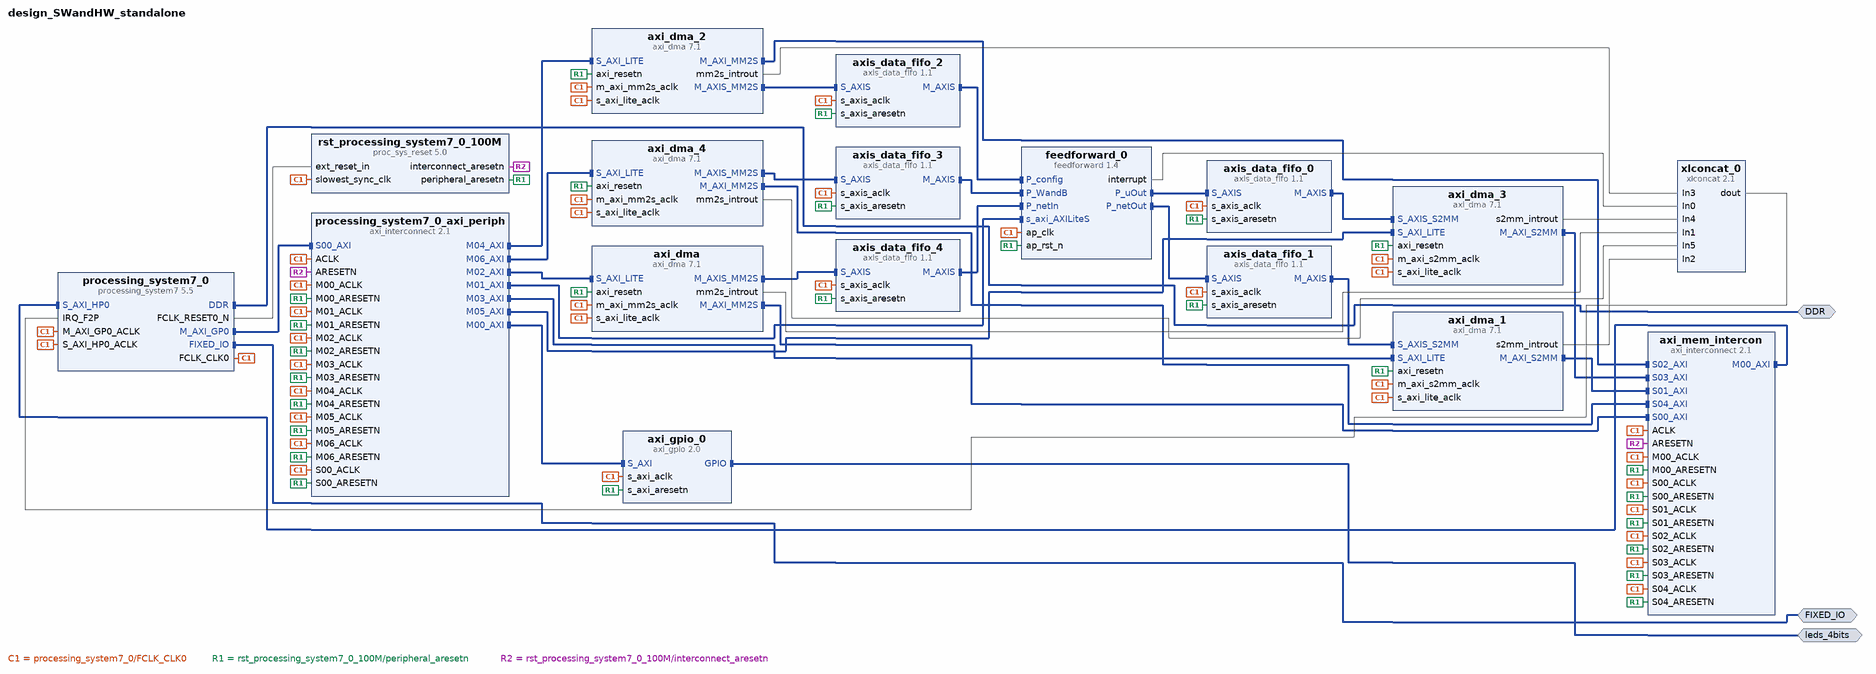
[diagram p0: block diagram of the top level]
# Vivado block design design_SWandHW_standalone, Vivado 2015.4.2
create_bd_design design_SWandHW_standalone

create_bd_intf_port -mode Master -vlnv xilinx.com:interface:ddrx_rtl:1.0 DDR
create_bd_intf_port -mode Master -vlnv xilinx.com:display_processing_system7:fixedio_rtl:1.0 FIXED_IO
create_bd_intf_port -mode Master -vlnv xilinx.com:interface:gpio_rtl:1.0 leds_4bits

create_bd_cell -type ip -vlnv xilinx.com:ip:processing_system7:5.5 processing_system7_0
set_property -dict [list \
  CONFIG.PCW_UIPARAM_DDR_FREQ_MHZ 525 \
  CONFIG.PCW_CRYSTAL_PERIPHERAL_FREQMHZ 50.000000 \
  CONFIG.PCW_APU_PERIPHERAL_FREQMHZ 650 \
  CONFIG.PCW_SDIO_PERIPHERAL_FREQMHZ 50 \
  CONFIG.PCW_FPGA0_PERIPHERAL_FREQMHZ 100 \
  CONFIG.PCW_USE_S_AXI_HP0 1 \
  CONFIG.PCW_USE_FABRIC_INTERRUPT 1 \
  CONFIG.PCW_S_AXI_HP0_DATA_WIDTH 32 \
  CONFIG.PCW_IRQ_F2P_INTR 1 \
  CONFIG.PCW_PRESET_BANK1_VOLTAGE {LVCMOS 1.8V} \
  CONFIG.PCW_UIPARAM_DDR_PARTNO {MT41K128M16 JT-125} \
  CONFIG.PCW_QSPI_PERIPHERAL_ENABLE 1 \
  CONFIG.PCW_QSPI_GRP_SINGLE_SS_ENABLE 1 \
  CONFIG.PCW_QSPI_GRP_FBCLK_ENABLE 1 \
  CONFIG.PCW_ENET0_PERIPHERAL_ENABLE 1 \
  CONFIG.PCW_ENET0_ENET0_IO {MIO 16 .. 27} \
  CONFIG.PCW_ENET0_GRP_MDIO_ENABLE 1 \
  CONFIG.PCW_ENET0_RESET_ENABLE 0 \
  CONFIG.PCW_SD0_PERIPHERAL_ENABLE 1 \
  CONFIG.PCW_SD0_GRP_CD_ENABLE 1 \
  CONFIG.PCW_SD0_GRP_CD_IO {MIO 47} \
  CONFIG.PCW_SD0_GRP_WP_ENABLE 1 \
  CONFIG.PCW_UART1_PERIPHERAL_ENABLE 1 \
  CONFIG.PCW_TTC0_PERIPHERAL_ENABLE 1 \
  CONFIG.PCW_USB0_PERIPHERAL_ENABLE 1 \
  CONFIG.PCW_USB0_RESET_ENABLE 1 \
  CONFIG.PCW_USB0_RESET_IO {MIO 46} \
  CONFIG.PCW_GPIO_MIO_GPIO_ENABLE 1 \
] [get_bd_cells processing_system7_0]
# 105 more settings of processing_system7_0 are not shown: defaults, MIO pin electricals, DDR timing, and values the tool derives
create_bd_cell -type ip -vlnv xilinx.com:ip:axi_gpio:2.0 axi_gpio_0
set_property -dict {CONFIG.USE_BOARD_FLOW true CONFIG.GPIO_BOARD_INTERFACE leds_4bits} [get_bd_cells axi_gpio_0]
create_bd_cell -type ip -vlnv xilinx.com:ip:axi_interconnect:2.1 processing_system7_0_axi_periph
set_property -dict {CONFIG.NUM_MI 7} [get_bd_cells processing_system7_0_axi_periph]
create_bd_cell -type ip -vlnv xilinx.com:ip:proc_sys_reset:5.0 rst_processing_system7_0_100M
create_bd_cell -type ip -vlnv UC3M:MISEA_Thesis:feedforward:1.4 feedforward_0
create_bd_cell -type ip -vlnv xilinx.com:ip:xlconcat:2.1 xlconcat_0
set_property -dict {CONFIG.NUM_PORTS 6} [get_bd_cells xlconcat_0]
create_bd_cell -type ip -vlnv xilinx.com:ip:axi_dma:7.1 axi_dma
set_property -dict [list \
  CONFIG.c_include_sg 0 \
  CONFIG.c_m_axi_mm2s_data_width 32 \
  CONFIG.c_m_axis_mm2s_tdata_width 32 \
  CONFIG.c_include_mm2s_dre 1 \
  CONFIG.c_mm2s_burst_size 256 \
  CONFIG.c_include_s2mm 0 \
] [get_bd_cells axi_dma]
create_bd_cell -type ip -vlnv xilinx.com:ip:axi_interconnect:2.1 axi_mem_intercon
set_property -dict {CONFIG.NUM_SI 5 CONFIG.NUM_MI 1} [get_bd_cells axi_mem_intercon]
create_bd_cell -type ip -vlnv xilinx.com:ip:axi_dma:7.1 axi_dma_1
set_property -dict [list \
  CONFIG.c_include_sg 0 \
  CONFIG.c_include_mm2s 0 \
  CONFIG.c_include_s2mm_dre 1 \
  CONFIG.c_s2mm_burst_size 256 \
] [get_bd_cells axi_dma_1]
create_bd_cell -type ip -vlnv xilinx.com:ip:axi_dma:7.1 axi_dma_2
set_property -dict [list \
  CONFIG.c_include_sg 0 \
  CONFIG.c_m_axi_mm2s_data_width 32 \
  CONFIG.c_m_axis_mm2s_tdata_width 32 \
  CONFIG.c_include_mm2s_dre 1 \
  CONFIG.c_mm2s_burst_size 256 \
  CONFIG.c_include_s2mm 0 \
] [get_bd_cells axi_dma_2]
create_bd_cell -type ip -vlnv xilinx.com:ip:axi_dma:7.1 axi_dma_3
set_property -dict [list \
  CONFIG.c_include_sg 0 \
  CONFIG.c_include_mm2s 0 \
  CONFIG.c_include_s2mm_dre 1 \
  CONFIG.c_s2mm_burst_size 256 \
] [get_bd_cells axi_dma_3]
create_bd_cell -type ip -vlnv xilinx.com:ip:axi_dma:7.1 axi_dma_4
set_property -dict [list \
  CONFIG.c_include_sg 0 \
  CONFIG.c_m_axi_mm2s_data_width 32 \
  CONFIG.c_m_axis_mm2s_tdata_width 32 \
  CONFIG.c_include_mm2s_dre 1 \
  CONFIG.c_mm2s_burst_size 256 \
  CONFIG.c_include_s2mm 0 \
] [get_bd_cells axi_dma_4]
create_bd_cell -type ip -vlnv xilinx.com:ip:axis_data_fifo:1.1 axis_data_fifo_0
set_property -dict {CONFIG.HAS_TKEEP 1 CONFIG.HAS_TLAST 1} [get_bd_cells axis_data_fifo_0]
create_bd_cell -type ip -vlnv xilinx.com:ip:axis_data_fifo:1.1 axis_data_fifo_1
set_property -dict {CONFIG.FIFO_DEPTH 16 CONFIG.HAS_TKEEP 1 CONFIG.HAS_TLAST 1} [get_bd_cells axis_data_fifo_1]
create_bd_cell -type ip -vlnv xilinx.com:ip:axis_data_fifo:1.1 axis_data_fifo_2
set_property -dict {CONFIG.FIFO_DEPTH 32} [get_bd_cells axis_data_fifo_2]
create_bd_cell -type ip -vlnv xilinx.com:ip:axis_data_fifo:1.1 axis_data_fifo_3
set_property -dict {CONFIG.FIFO_DEPTH 2048} [get_bd_cells axis_data_fifo_3]
create_bd_cell -type ip -vlnv xilinx.com:ip:axis_data_fifo:1.1 axis_data_fifo_4
set_property -dict {CONFIG.FIFO_DEPTH 256} [get_bd_cells axis_data_fifo_4]

# ---- connections ----

connect_bd_intf_net [get_bd_intf_pins processing_system7_0/M_AXI_GP0] [get_bd_intf_pins processing_system7_0_axi_periph/S00_AXI]
connect_bd_intf_net [get_bd_intf_pins processing_system7_0_axi_periph/M00_AXI] [get_bd_intf_pins axi_gpio_0/S_AXI]
connect_bd_intf_net [get_bd_intf_pins processing_system7_0_axi_periph/M01_AXI] [get_bd_intf_pins feedforward_0/s_axi_AXILiteS]
connect_bd_intf_net [get_bd_intf_pins axi_dma/M_AXI_MM2S] [get_bd_intf_pins axi_mem_intercon/S00_AXI]
connect_bd_intf_net [get_bd_intf_pins axi_mem_intercon/M00_AXI] [get_bd_intf_pins processing_system7_0/S_AXI_HP0]
connect_bd_intf_net [get_bd_intf_pins axi_dma_1/M_AXI_S2MM] [get_bd_intf_pins axi_mem_intercon/S01_AXI]
connect_bd_intf_net [get_bd_intf_pins axi_dma_2/M_AXI_MM2S] [get_bd_intf_pins axi_mem_intercon/S02_AXI]
connect_bd_intf_net [get_bd_intf_pins axi_dma_3/M_AXI_S2MM] [get_bd_intf_pins axi_mem_intercon/S03_AXI]
connect_bd_intf_net [get_bd_intf_pins axi_dma_4/M_AXI_MM2S] [get_bd_intf_pins axi_mem_intercon/S04_AXI]
connect_bd_intf_net [get_bd_intf_pins processing_system7_0_axi_periph/M02_AXI] [get_bd_intf_pins axi_dma/S_AXI_LITE]
connect_bd_intf_net [get_bd_intf_pins processing_system7_0_axi_periph/M03_AXI] [get_bd_intf_pins axi_dma_1/S_AXI_LITE]
connect_bd_intf_net [get_bd_intf_pins processing_system7_0_axi_periph/M04_AXI] [get_bd_intf_pins axi_dma_2/S_AXI_LITE]
connect_bd_intf_net [get_bd_intf_pins processing_system7_0_axi_periph/M05_AXI] [get_bd_intf_pins axi_dma_3/S_AXI_LITE]
connect_bd_intf_net [get_bd_intf_pins processing_system7_0_axi_periph/M06_AXI] [get_bd_intf_pins axi_dma_4/S_AXI_LITE]
connect_bd_intf_net [get_bd_intf_pins feedforward_0/P_uOut] [get_bd_intf_pins axis_data_fifo_0/S_AXIS]
connect_bd_intf_net [get_bd_intf_pins axis_data_fifo_0/M_AXIS] [get_bd_intf_pins axi_dma_3/S_AXIS_S2MM]
connect_bd_intf_net [get_bd_intf_pins feedforward_0/P_netOut] [get_bd_intf_pins axis_data_fifo_1/S_AXIS]
connect_bd_intf_net [get_bd_intf_pins axis_data_fifo_1/M_AXIS] [get_bd_intf_pins axi_dma_1/S_AXIS_S2MM]
connect_bd_intf_net [get_bd_intf_pins axi_dma_2/M_AXIS_MM2S] [get_bd_intf_pins axis_data_fifo_2/S_AXIS]
connect_bd_intf_net [get_bd_intf_pins axis_data_fifo_2/M_AXIS] [get_bd_intf_pins feedforward_0/P_config]
connect_bd_intf_net [get_bd_intf_pins axi_dma_4/M_AXIS_MM2S] [get_bd_intf_pins axis_data_fifo_3/S_AXIS]
connect_bd_intf_net [get_bd_intf_pins axis_data_fifo_3/M_AXIS] [get_bd_intf_pins feedforward_0/P_WandB]
connect_bd_intf_net [get_bd_intf_pins axis_data_fifo_4/S_AXIS] [get_bd_intf_pins axi_dma/M_AXIS_MM2S]
connect_bd_intf_net [get_bd_intf_pins axis_data_fifo_4/M_AXIS] [get_bd_intf_pins feedforward_0/P_netIn]
connect_bd_intf_net [get_bd_intf_ports DDR] [get_bd_intf_pins processing_system7_0/DDR]
connect_bd_intf_net [get_bd_intf_ports FIXED_IO] [get_bd_intf_pins processing_system7_0/FIXED_IO]
connect_bd_intf_net [get_bd_intf_ports leds_4bits] [get_bd_intf_pins axi_gpio_0/GPIO]
connect_bd_net [get_bd_pins processing_system7_0/FCLK_CLK0] \
  [get_bd_pins processing_system7_0/M_AXI_GP0_ACLK] [get_bd_pins processing_system7_0_axi_periph/S00_ACLK] \
  [get_bd_pins rst_processing_system7_0_100M/slowest_sync_clk] [get_bd_pins processing_system7_0_axi_periph/ACLK] \
  [get_bd_pins axi_gpio_0/s_axi_aclk] [get_bd_pins processing_system7_0_axi_periph/M00_ACLK] \
  [get_bd_pins feedforward_0/ap_clk] [get_bd_pins processing_system7_0_axi_periph/M01_ACLK] \
  [get_bd_pins axi_dma/m_axi_mm2s_aclk] [get_bd_pins axi_mem_intercon/S00_ACLK] [get_bd_pins axi_mem_intercon/ACLK] \
  [get_bd_pins processing_system7_0/S_AXI_HP0_ACLK] [get_bd_pins axi_mem_intercon/M00_ACLK] \
  [get_bd_pins axi_dma_1/m_axi_s2mm_aclk] [get_bd_pins axi_mem_intercon/S01_ACLK] [get_bd_pins axi_dma_2/m_axi_mm2s_aclk] \
  [get_bd_pins axi_mem_intercon/S02_ACLK] [get_bd_pins axi_dma_3/m_axi_s2mm_aclk] [get_bd_pins axi_mem_intercon/S03_ACLK] \
  [get_bd_pins axi_dma_4/m_axi_mm2s_aclk] [get_bd_pins axi_mem_intercon/S04_ACLK] [get_bd_pins axi_dma/s_axi_lite_aclk] \
  [get_bd_pins processing_system7_0_axi_periph/M02_ACLK] [get_bd_pins axi_dma_1/s_axi_lite_aclk] \
  [get_bd_pins processing_system7_0_axi_periph/M03_ACLK] [get_bd_pins axi_dma_2/s_axi_lite_aclk] \
  [get_bd_pins processing_system7_0_axi_periph/M04_ACLK] [get_bd_pins axi_dma_3/s_axi_lite_aclk] \
  [get_bd_pins processing_system7_0_axi_periph/M05_ACLK] [get_bd_pins axi_dma_4/s_axi_lite_aclk] \
  [get_bd_pins processing_system7_0_axi_periph/M06_ACLK] [get_bd_pins axis_data_fifo_1/s_axis_aclk] \
  [get_bd_pins axis_data_fifo_0/s_axis_aclk] [get_bd_pins axis_data_fifo_4/s_axis_aclk] \
  [get_bd_pins axis_data_fifo_3/s_axis_aclk] [get_bd_pins axis_data_fifo_2/s_axis_aclk]
connect_bd_net [get_bd_pins processing_system7_0/FCLK_RESET0_N] [get_bd_pins rst_processing_system7_0_100M/ext_reset_in]
connect_bd_net [get_bd_pins rst_processing_system7_0_100M/peripheral_aresetn] \
  [get_bd_pins processing_system7_0_axi_periph/S00_ARESETN] [get_bd_pins axi_gpio_0/s_axi_aresetn] \
  [get_bd_pins processing_system7_0_axi_periph/M00_ARESETN] [get_bd_pins feedforward_0/ap_rst_n] \
  [get_bd_pins processing_system7_0_axi_periph/M01_ARESETN] [get_bd_pins axi_mem_intercon/S00_ARESETN] \
  [get_bd_pins axi_mem_intercon/M00_ARESETN] [get_bd_pins axi_mem_intercon/S01_ARESETN] \
  [get_bd_pins axi_mem_intercon/S02_ARESETN] [get_bd_pins axi_mem_intercon/S03_ARESETN] \
  [get_bd_pins axi_mem_intercon/S04_ARESETN] [get_bd_pins axi_dma/axi_resetn] \
  [get_bd_pins processing_system7_0_axi_periph/M02_ARESETN] [get_bd_pins axi_dma_1/axi_resetn] \
  [get_bd_pins processing_system7_0_axi_periph/M03_ARESETN] [get_bd_pins axi_dma_2/axi_resetn] \
  [get_bd_pins processing_system7_0_axi_periph/M04_ARESETN] [get_bd_pins axi_dma_3/axi_resetn] \
  [get_bd_pins processing_system7_0_axi_periph/M05_ARESETN] [get_bd_pins axi_dma_4/axi_resetn] \
  [get_bd_pins processing_system7_0_axi_periph/M06_ARESETN] [get_bd_pins axis_data_fifo_1/s_axis_aresetn] \
  [get_bd_pins axis_data_fifo_0/s_axis_aresetn] [get_bd_pins axis_data_fifo_4/s_axis_aresetn] \
  [get_bd_pins axis_data_fifo_3/s_axis_aresetn] [get_bd_pins axis_data_fifo_2/s_axis_aresetn]
connect_bd_net [get_bd_pins rst_processing_system7_0_100M/interconnect_aresetn] \
  [get_bd_pins processing_system7_0_axi_periph/ARESETN] [get_bd_pins axi_mem_intercon/ARESETN]
connect_bd_net [get_bd_pins feedforward_0/interrupt] [get_bd_pins xlconcat_0/In0]
connect_bd_net [get_bd_pins xlconcat_0/dout] [get_bd_pins processing_system7_0/IRQ_F2P]
connect_bd_net [get_bd_pins axi_dma/mm2s_introut] [get_bd_pins xlconcat_0/In1]
connect_bd_net [get_bd_pins axi_dma_1/s2mm_introut] [get_bd_pins xlconcat_0/In2]
connect_bd_net [get_bd_pins axi_dma_2/mm2s_introut] [get_bd_pins xlconcat_0/In3]
connect_bd_net [get_bd_pins axi_dma_3/s2mm_introut] [get_bd_pins xlconcat_0/In4]
connect_bd_net [get_bd_pins axi_dma_4/mm2s_introut] [get_bd_pins xlconcat_0/In5]

# ---- address map ----
assign_bd_address -offset 0x00000000 -range 512M -target_address_space [get_bd_addr_spaces axi_dma/Data_MM2S] [get_bd_addr_segs processing_system7_0/S_AXI_HP0/HP0_DDR_LOWOCM]
assign_bd_address -offset 0x00000000 -range 512M -target_address_space [get_bd_addr_spaces axi_dma_1/Data_S2MM] [get_bd_addr_segs processing_system7_0/S_AXI_HP0/HP0_DDR_LOWOCM]
assign_bd_address -offset 0x00000000 -range 512M -target_address_space [get_bd_addr_spaces axi_dma_2/Data_MM2S] [get_bd_addr_segs processing_system7_0/S_AXI_HP0/HP0_DDR_LOWOCM]
assign_bd_address -offset 0x00000000 -range 512M -target_address_space [get_bd_addr_spaces axi_dma_3/Data_S2MM] [get_bd_addr_segs processing_system7_0/S_AXI_HP0/HP0_DDR_LOWOCM]
assign_bd_address -offset 0x00000000 -range 512M -target_address_space [get_bd_addr_spaces axi_dma_4/Data_MM2S] [get_bd_addr_segs processing_system7_0/S_AXI_HP0/HP0_DDR_LOWOCM]
assign_bd_address -offset 0x40400000 -range 64K -target_address_space [get_bd_addr_spaces processing_system7_0/Data] [get_bd_addr_segs axi_dma/S_AXI_LITE/Reg]
assign_bd_address -offset 0x40410000 -range 64K -target_address_space [get_bd_addr_spaces processing_system7_0/Data] [get_bd_addr_segs axi_dma_1/S_AXI_LITE/Reg]
assign_bd_address -offset 0x40420000 -range 64K -target_address_space [get_bd_addr_spaces processing_system7_0/Data] [get_bd_addr_segs axi_dma_2/S_AXI_LITE/Reg]
assign_bd_address -offset 0x40430000 -range 64K -target_address_space [get_bd_addr_spaces processing_system7_0/Data] [get_bd_addr_segs axi_dma_3/S_AXI_LITE/Reg]
assign_bd_address -offset 0x40440000 -range 64K -target_address_space [get_bd_addr_spaces processing_system7_0/Data] [get_bd_addr_segs axi_dma_4/S_AXI_LITE/Reg]
assign_bd_address -offset 0x41200000 -range 64K -target_address_space [get_bd_addr_spaces processing_system7_0/Data] [get_bd_addr_segs axi_gpio_0/S_AXI/Reg]
assign_bd_address -offset 0x43C00000 -range 64K -target_address_space [get_bd_addr_spaces processing_system7_0/Data] [get_bd_addr_segs feedforward_0/s_axi_AXILiteS/Reg]

validate_bd_design
save_bd_design
